# EAGLE schematic ADS7046_v6 (EAGLE 9.6.2)
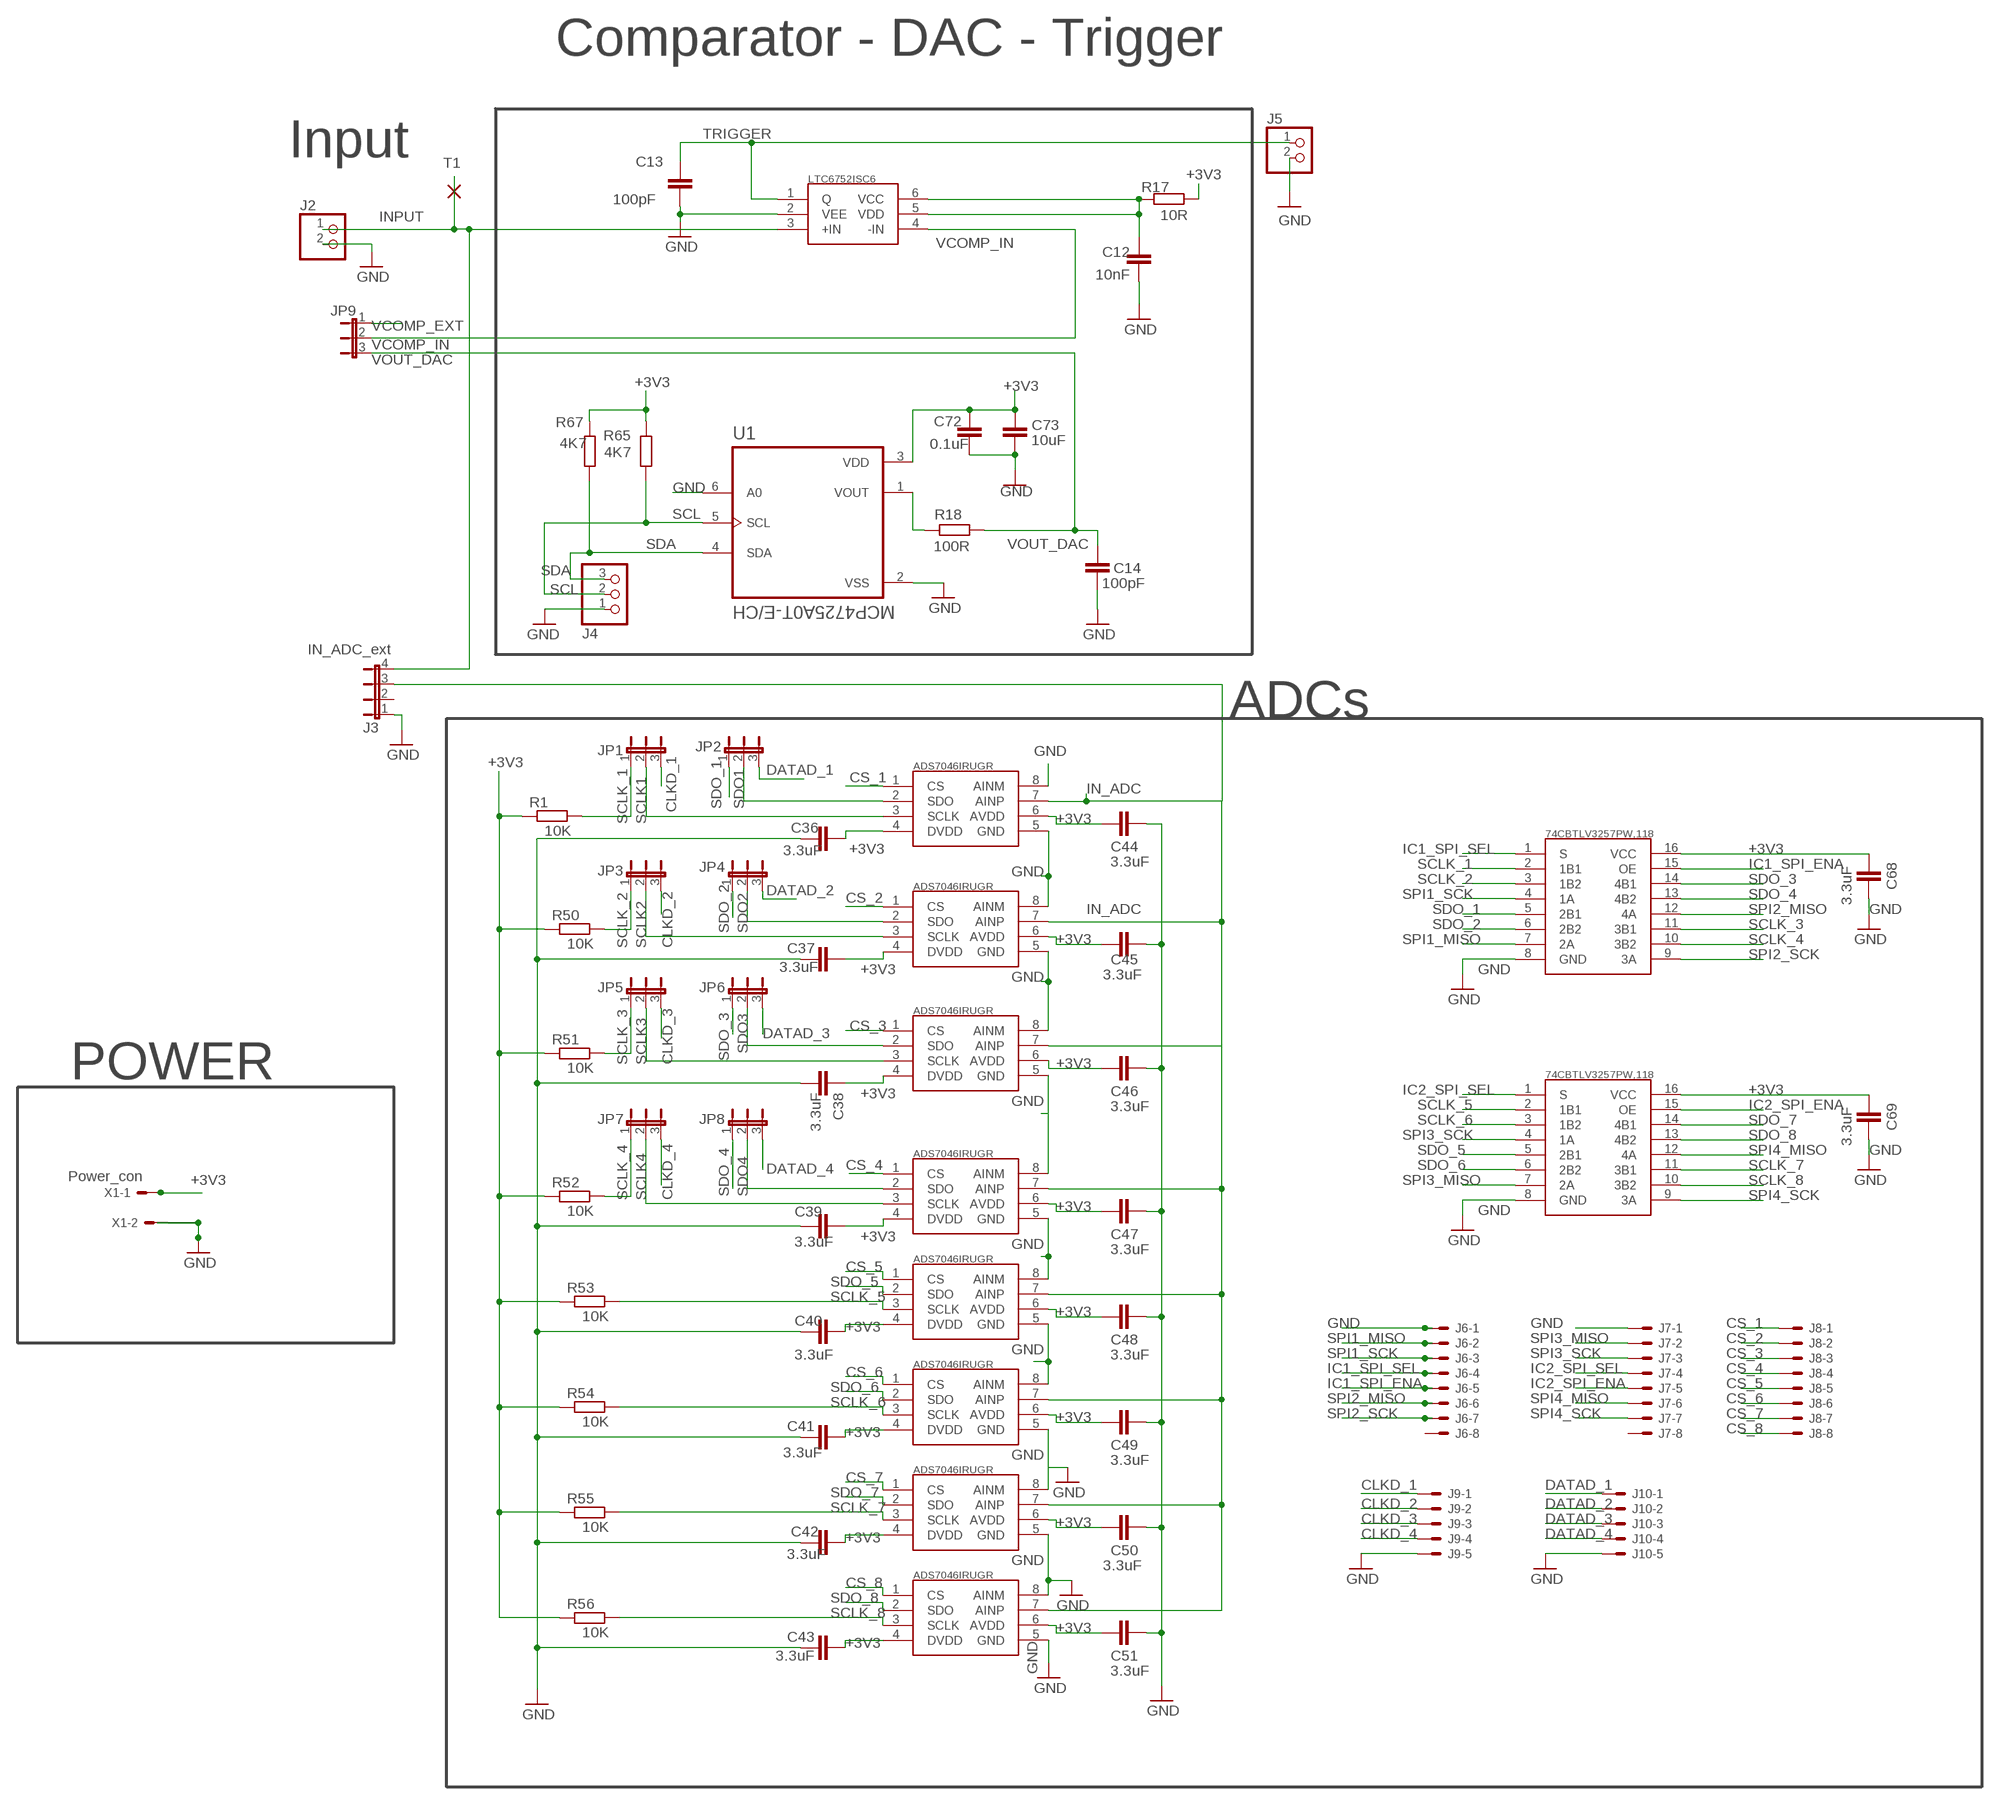
[diagram p0: schematic, sheet 1]

## Parts
C12  10nF  C-EUC1206  [C1206]
C13  100pF  C-EUC1206  [C1206]
C14  100pF  C-EUC1206  [C1206]
C36  3.3uF  C-EUC0805  [C0805]
C37  3.3uF  C-EUC0805  [C0805]
C38  3.3uF  C-EUC0805  [C0805]
C39  3.3uF  C-EUC0805  [C0805]
C40  3.3uF  C-EUC0805  [C0805]
C41  3.3uF  C-EUC0805  [C0805]
C42  3.3uF  C-EUC0805  [C0805]
C43  3.3uF  C-EUC0805  [C0805]
C44  3.3uF  C-EUC0805  [C0805]
C45  3.3uF  C-EUC0805  [C0805]
C46  3.3uF  C-EUC0805  [C0805]
C47  3.3uF  C-EUC0805  [C0805]
C48  3.3uF  C-EUC0805  [C0805]
C49  3.3uF  C-EUC0805  [C0805]
C50  3.3uF  C-EUC0805  [C0805]
C51  3.3uF  C-EUC0805  [C0805]
C68  3.3uF  C-EUC0805  [C0805]
C69  3.3uF  C-EUC0805  [C0805]
C72  0.1uF  C-EUC0805  [C0805]
C73  10uF  C-EUC0805  [C0805]
J2  PINHD-1X2  [1X02]
J3  IN_ADC_ext  JP4E  [JP4]
J4  PINHD-1X3  [1X03]
J5  PINHD-1X2  [1X02]
J6  22-27-2081-08  [6410-08]
J7  22-27-2081-08  [6410-08]
J8  22-27-2081-08  [6410-08]
J9  22-27-2051-05  [6410-05]
J10  22-27-2051-05  [6410-05]
JP1  JP2E  [JP2]
JP2  JP2E  [JP2]
JP3  JP2E  [JP2]
JP4  JP2E  [JP2]
JP5  JP2E  [JP2]
JP6  JP2E  [JP2]
JP7  JP2E  [JP2]
JP8  JP2E  [JP2]
JP9  JP2E  [JP2]
R1  10K  R-EU_R0805  [R0805]
R17  10R  R-EU_R1206  [R1206]
R18  100R  R-EU_R1206  [R1206]
R50  10K  R-EU_R0805  [R0805]
R51  10K  R-EU_R0805  [R0805]
R52  10K  R-EU_R0805  [R0805]
R53  10K  R-EU_R0805  [R0805]
R54  10K  R-EU_R0805  [R0805]
R55  10K  R-EU_R0805  [R0805]
R56  10K  R-EU_R0805  [R0805]
R65  4K7  R-EU_R0805  [R0805]
R67  4K7  R-EU_R0805  [R0805]
T1  WIREPADSMD1,27-254  [SMD1,27-2,54]
U1  MCP4725A0T-E/CH  [SOT95P270X145-6N]
U$2  LTC6752ISC6  [LTC6752ISC6]
U$12  ADS7046IRUGR  [ADS7046IRUGR]
U$13  ADS7046IRUGR  [ADS7046IRUGR]
U$14  ADS7046IRUGR  [ADS7046IRUGR]
U$15  ADS7046IRUGR  [ADS7046IRUGR]
U$16  ADS7046IRUGR  [ADS7046IRUGR]
U$17  ADS7046IRUGR  [ADS7046IRUGR]
U$18  ADS7046IRUGR  [ADS7046IRUGR]
U$19  ADS7046IRUGR  [ADS7046IRUGR]
U$28  74CBTLV3257PW,118  [TSSOP16]
U$29  74CBTLV3257PW,118  [TSSOP16]
X1  Power_con  22-23-2021  [22-23-2021]

## Nets
+3V3: C36.1 C37.1 C38.1 C39.1 C40.1 C41.1 C42.1 C43.1 C44.2 C45.2 C46.2 C47.2 C48.2 C49.2 C50.2 C51.2 C68.1 C69.1 C72.1 C73.1 R1.1 R17.1 R50.1 R51.1 R52.1 R53.1 R54.1 R55.1 R56.1 R65.2 R67.1 U1.3(VDD) U$12.4(DVDD) U$12.6(AVDD) U$13.4(DVDD) U$13.6(AVDD) U$14.4(DVDD) U$14.6(AVDD) U$15.4(DVDD) U$15.6(AVDD) U$16.4(DVDD) U$16.6(AVDD) U$17.4(DVDD) U$17.6(AVDD) U$18.4(DVDD) U$18.6(AVDD) U$19.4(DVDD) U$19.6(AVDD) U$28.16(VCC) U$29.16(VCC) X1.1
CLKD_1: J9.1 JP1.3
CLKD_2: J9.2 JP3.3
CLKD_3: J9.3 JP5.3
CLKD_4: J9.4 JP7.3
CS_1: J8.1 U$12.1(CS)
CS_2: J8.2 U$13.1(CS)
CS_3: J8.3 U$14.1(CS)
CS_4: J8.4 U$15.1(CS)
CS_5: J8.5 U$16.1(CS)
CS_6: J8.6 U$17.1(CS)
CS_7: J8.7 U$18.1(CS)
CS_8: J8.8 U$19.1(CS)
DATAD_1: J10.1 JP2.3
DATAD_2: J10.2 JP4.3
DATAD_3: J10.3 JP6.3
DATAD_4: J10.4 JP8.3
GND: C12.2 C13.2 C14.2 C36.2 C37.2 C38.2 C39.2 C40.2 C41.2 C42.2 C43.2 C44.1 C45.1 C46.1 C47.1 C48.1 C49.1 C50.1 C51.1 C68.2 C69.2 C72.2 C73.2 J2.2 J3.1 J4.1 J5.2 J6.1 J7.1 J9.5 J10.5 U1.2(VSS) U1.6(A0) U$2.2(VEE) U$12.5(GND) U$12.8(AINM) U$13.5(GND) U$13.8(AINM) U$14.5(GND) U$14.8(AINM) U$15.5(GND) U$15.8(AINM) U$16.5(GND) U$16.8(AINM) U$17.5(GND) U$17.8(AINM) U$18.5(GND) U$18.8(AINM) U$19.5(GND) U$19.8(AINM) U$28.8(GND) U$29.8(GND) X1.2
IC1_SPI_ENA: J6.5 U$28.15(OE)
IC1_SPI_SEL: J6.4 U$28.1(S)
IC2_SPI_ENA: J7.5 U$29.15(OE)
IC2_SPI_SEL: J7.4 U$29.1(S)
IN_ADC: J3.3 U$12.7(AINP) U$13.7(AINP) U$14.7(AINP) U$15.7(AINP) U$16.7(AINP) U$17.7(AINP) U$18.7(AINP) U$19.7(AINP)
INPUT: J2.1 J3.4 T1.1(P) U$2.3(+IN)
N$11: C12.1 R17.2 U$2.5(VDD) U$2.6(VCC)
N$12: R18.2 U1.1(VOUT)
SCL: J4.2 R65.1 U1.5(SCL)
SCLK1: JP1.2 U$12.3(SCLK)
SCLK2: JP3.2 U$13.3(SCLK)
SCLK3: JP5.2 U$14.3(SCLK)
SCLK4: JP7.2 U$15.3(SCLK)
SCLK_1: JP1.1 R1.2 U$28.2(1B1)
SCLK_2: JP3.1 R50.2 U$28.3(1B2)
SCLK_3: JP5.1 R51.2 U$28.11(3B1)
SCLK_4: JP7.1 R52.2 U$28.10(3B2)
SCLK_5: R53.2 U$16.3(SCLK) U$29.2(1B1)
SCLK_6: R54.2 U$17.3(SCLK) U$29.3(1B2)
SCLK_7: R55.2 U$18.3(SCLK) U$29.11(3B1)
SCLK_8: R56.2 U$19.3(SCLK) U$29.10(3B2)
SDA: J4.3 R67.2 U1.4(SDA)
SDO1: JP2.2 U$12.2(SDO)
SDO2: JP4.2 U$13.2(SDO)
SDO3: JP6.2 U$14.2(SDO)
SDO4: JP8.2 U$15.2(SDO)
SDO_1: JP2.1 U$28.5(2B1)
SDO_2: JP4.1 U$28.6(2B2)
SDO_3: JP6.1 U$28.14(4B1)
SDO_4: JP8.1 U$28.13(4B2)
SDO_5: U$16.2(SDO) U$29.5(2B1)
SDO_6: U$17.2(SDO) U$29.6(2B2)
SDO_7: U$18.2(SDO) U$29.14(4B1)
SDO_8: U$19.2(SDO) U$29.13(4B2)
SPI1_MISO: J6.2 U$28.7(2A)
SPI1_SCK: J6.3 U$28.4(1A)
SPI2_MISO: J6.6 U$28.12(4A)
SPI2_SCK: J6.7 U$28.9(3A)
SPI3_MISO: J7.2 U$29.7(2A)
SPI3_SCK: J7.3 U$29.4(1A)
SPI4_MISO: J7.6 U$29.12(4A)
SPI4_SCK: J7.7 U$29.9(3A)
TRIGGER: C13.1 J5.1 U$2.1(Q)
VCOMP_EXT: JP9.1
VCOMP_IN: JP9.2 U$2.4(-IN)
VOUT_DAC: C14.1 JP9.3 R18.1
Unconnected: J3.2 J6.8 J7.8

## Notes on the sheet
- Comparator - DAC - Trigger
- Input
- ADCs
- POWER

## Library data of the parts
C12-C14 C36-C51 C68 C69 C72 C73 = rcl:C-EU: CAPACITOR, European symbol; SPICEPREFIX: C
J2 J5 = pinhead:PINHD-1X2: PIN HEADER
J3 = jumper:JP4E: JUMPER
J4 = pinhead:PINHD-1X3: PIN HEADER
J6-J8 = con-molex:22-?-08: CONNECTOR wire to board 2.54 mm (.1 inch) pitch header; MF: MOLEX; OC_FARNELL: unknown; OC_NEWARK: unknown
J9 J10 = con-molex:22-?-05: CONNECTOR wire to board 2.54 mm (.1 inch) pitch header; MF: MOLEX; OC_FARNELL: unknown; OC_NEWARK: unknown
JP1-JP9 = jumper:JP2E: JUMPER
R1 R17 R18 R50-R56 R65 R67 = rcl:R-EU_: RESISTOR, European symbol; SPICEPREFIX: R
T1 = wirepad:WIREPAD: Wire PAD connect wire on PCB
U1 = MCP4725A0T-E_CH:MCP4725A0T-E/CH: MCP4725 Series 1 Ch I2C EEPROM Memory 5.5 V 12-Bit D/A Converter SMT - SOT-23-6 Check availability <https://pricing.snapeda.com/parts/MCP4725A0T-E/CH/Microchip/view-part?ref=eda>; AVAILABILITY: In Stock; CHECK_PRICES: https://www.snapeda.com/parts/MCP4725A0T-E/CH/Microchip/view-part/?ref=eda; DESCRIPTION: Microchip 12 bit Serial DAC 6-Pin SOT-23A | Microchip Technology Inc. MCP4725A0T-E/CH; MF: Microchip; MP: MCP4725A0T-E/CH; PACKAGE: SOT-23-6 Microchip; PRICE: None; SNAPEDA_LINK: https://www.snapeda.com/parts/MCP4725A0T-E/CH/Microchip/view-part/?ref=snap
U$2 = Analog_Devices_ByChris:LTC6752ISC6
U$12-U$19 = Analog_Devices_ByChris:ADS7046IRUGR
U$28 U$29 = Analog_Devices_ByChris:74CBTLV3257PW,118
X1 = con-molex:22-23-2021: .100" (2.54mm) Center Header - 2 Pin; MF: MOLEX; MPN: 22-23-2021; OC_FARNELL: 1462926; OC_NEWARK: 25C3832